# Altium schematic sheet 010_SoC RGMII & GBE PHY.SchDoc
size 420 x 297 mm; Page Create Date: May 29, 2006; WebSite: https://www.seeedstudio.com; Page Number: 10; Drawing: qxn; Schematic Name: BeaglePlay; Page Size: A3; Page Count: 22; Page Name: 010_SoC RGMII & GBE PHY; Company: Seeed Studio; RevCode: v0.2; DsnPath: C:\Users\a0488739\Documents\GitHub\beagleplay\allegro\DVT\BEAGLEPLAYV020_220915.DSN; SchematicName: BeaglePlay; PageName: 010_SoC RGMII & GBE PHY; PageSize: A3; TopSchematic: True
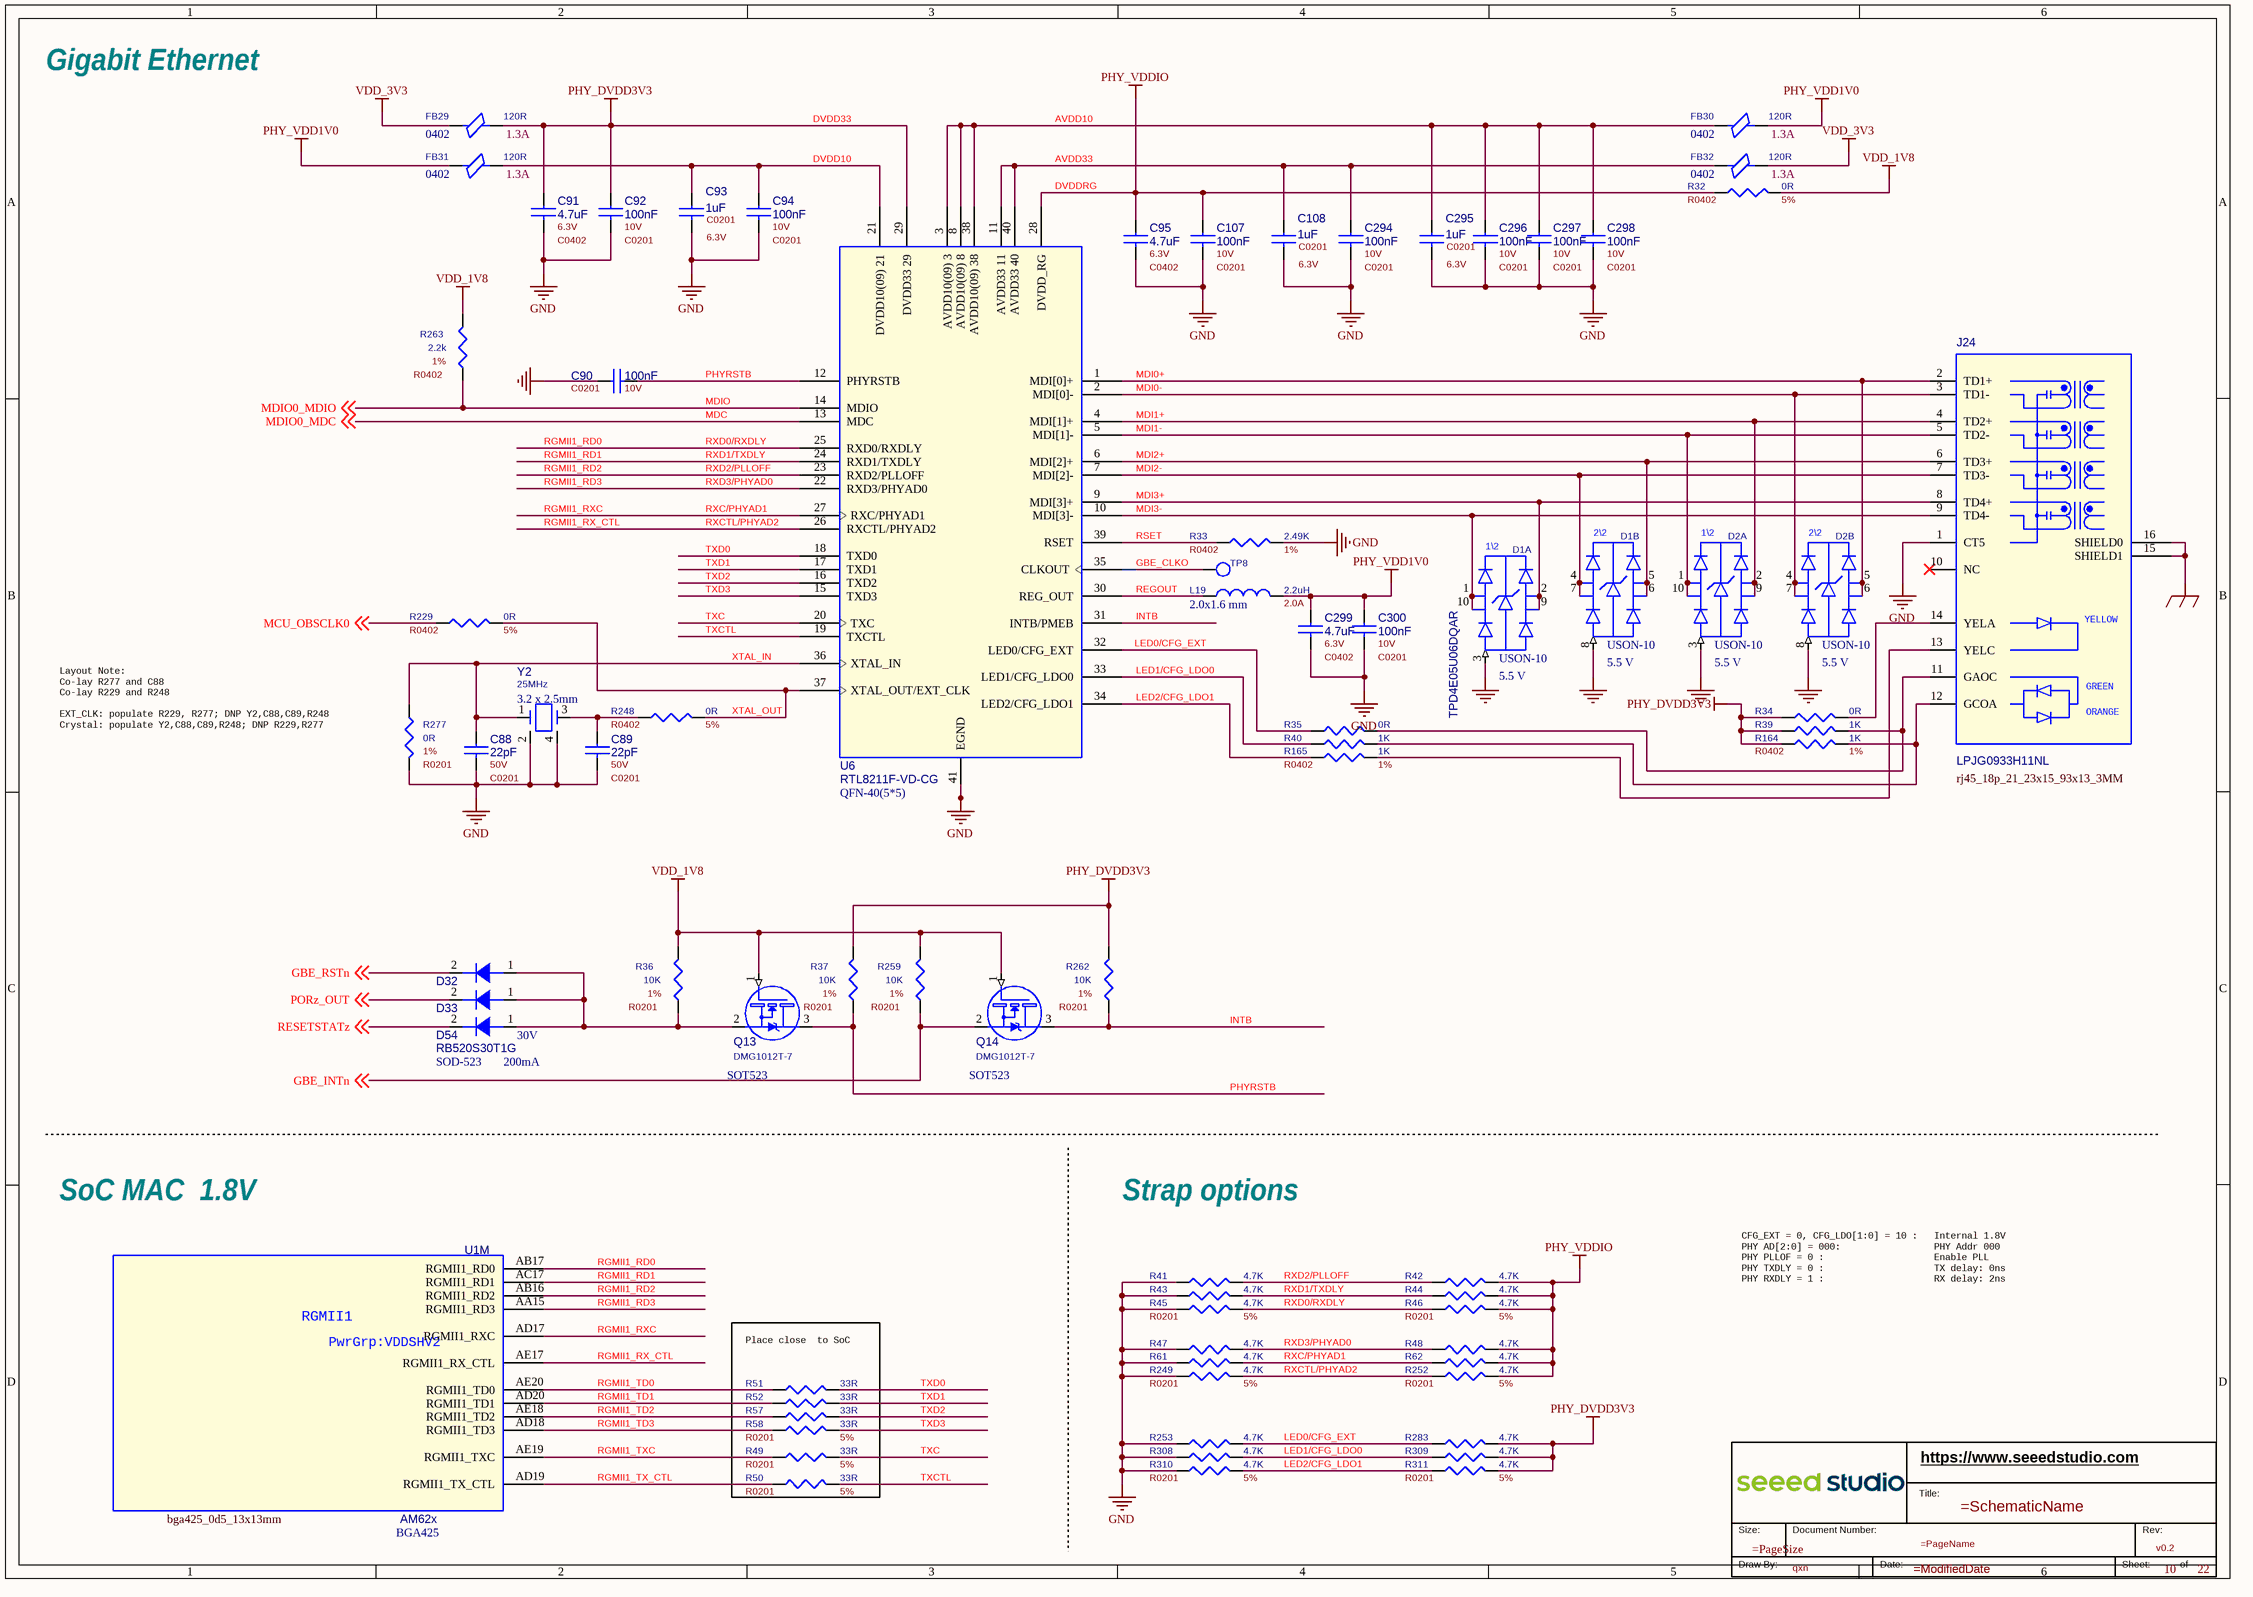
[diagram p0: 010_SoC RGMII & GBE PHY.SchDoc]

## Parts
*  RevCode: v0.2  Page Number: 10  Page Count: 22  Drawing: qxn  (graphical)
C88  value 22pF  Rating: 50V  [C0201]  (hidden comment: CC)
C89  value 22pF  Rating: 50V  [C0201]  (hidden comment: CC)
C90  value 100nF  Rating: 10V  [C0201]  (hidden comment: CC)
C91  value 4.7uF  Rating: 6.3V  [C0402]  (hidden comment: CC)
C92  value 100nF  Rating: 10V  [C0201]  (hidden comment: CC)
C93  value 1uF  Rating: 6.3V  [C0201]  (hidden comment: CC)
C94  value 100nF  Rating: 10V  [C0201]  (hidden comment: CC)
C95  value 4.7uF  Rating: 6.3V  [C0402]  (hidden comment: CC)
C107  value 100nF  Rating: 10V  [C0201]  (hidden comment: CC)
C108  value 1uF  Rating: 6.3V  [C0201]  (hidden comment: CC)
C294  value 100nF  Rating: 10V  [C0201]  (hidden comment: CC)
C295  value 1uF  Rating: 6.3V  [C0201]  (hidden comment: CC)
C296  value 100nF  Rating: 10V  [C0201]  (hidden comment: CC)
C297  value 100nF  Rating: 10V  [C0201]  (hidden comment: CC)
C298  value 100nF  Rating: 10V  [C0201]  (hidden comment: CC)
C299  value 4.7uF  Rating: 6.3V  [C0402]  (hidden comment: CC)
C300  value 100nF  Rating: 10V  [C0201]  (hidden comment: CC)
D1  value TPD4E05U06DQAR  Package Size: USON-10  Rated Voltage: 5.5 V  [uson10_0d5_2d5x1x0d5mm]  (hidden comment: D_ESD_DIFFPAIR)  (parts A,B of 2)
D2  Rated Voltage: 5.5 V  Package Size: USON-10  [uson10_0d5_2d5x1x0d5mm]  (hidden comment: D_ESD_DIFFPAIR)  (parts A,B of 2)
D32  D  [sod_523]  (value not drawn)
D33  D  [sod_523]  (value not drawn)
D54  value RB520S30T1G  Repetitive Reverse Voltage Maximum: 30V  Peak Forward Current: 200mA  Package Size: SOD-523  [sod_523]  (hidden comment: D)
FB29  value 120R  Rating: 1.3A  Package Size: 0402  [L0402]  (hidden comment: FB)
FB30  value 120R  Rating: 1.3A  Package Size: 0402  [L0402]  (hidden comment: FB)
FB31  value 120R  Rating: 1.3A  Package Size: 0402  [L0402]  (hidden comment: FB)
FB32  value 120R  Rating: 1.3A  Package Size: 0402  [L0402]  (hidden comment: FB)
J24  value LPJG0933H11NL  [rj45_18p_21_23x15_93x13_3MM]  (hidden comment: RJ45_LPJG0933H11NL)
L19  value 2.2uH  Rating: 2.0A  Package Size: 2.0x1.6 mm  [L2016]  (hidden comment: L)
Q13  value DMG1012T-7  Package Size: SOT523  [SOT_523]  (hidden comment: NMOS_123)
Q14  value DMG1012T-7  Package Size: SOT523  [SOT_523]  (hidden comment: NMOS_123)
R32  value 0R  Rating: 5%  [R0402]  (hidden comment: R)
R33  value 2.49K  Rating: 1%  [R0402]  (hidden comment: R)
R34  value 0R  [R0402]  (hidden comment: R)
R35  value 0R  [R0402]  (hidden comment: R)
R36  value 10K  Rating: 1%  [R0201]  (hidden comment: R)
R37  value 10K  Rating: 1%  [R0201]  (hidden comment: R)
R39  value 1K  [R0402]  (hidden comment: R)
R40  value 1K  [R0402]  (hidden comment: R)
R41  value 4.7K  [R0201]  (hidden comment: R)
R42  value 4.7K  [R0201]  (hidden comment: R)
R43  value 4.7K  [R0201]  (hidden comment: R)
R44  value 4.7K  [R0201]  (hidden comment: R)
R45  value 4.7K  Rating: 5%  [R0201]  (hidden comment: R)
R46  value 4.7K  Rating: 5%  [R0201]  (hidden comment: R)
R47  value 4.7K  [R0201]  (hidden comment: R)
R48  value 4.7K  [R0201]  (hidden comment: R)
R49  value 33R  Rating: 5%  [R0201]  (hidden comment: R)
R50  value 33R  Rating: 5%  [R0201]  (hidden comment: R)
R51  value 33R  [R0201]  (hidden comment: R)
R52  value 33R  [R0201]  (hidden comment: R)
R57  value 33R  [R0201]  (hidden comment: R)
R58  value 33R  Rating: 5%  [R0201]  (hidden comment: R)
R61  value 4.7K  [R0201]  (hidden comment: R)
R62  value 4.7K  [R0201]  (hidden comment: R)
R164  value 1K  Rating: 1%  [R0402]  (hidden comment: R)
R165  value 1K  Rating: 1%  [R0402]  (hidden comment: R)
R229  value 0R  Rating: 5%  [R0402]  (hidden comment: R)
R248  value 0R  Rating: 5%  [R0402]  (hidden comment: R)
R249  value 4.7K  Rating: 5%  [R0201]  (hidden comment: R)
R252  value 4.7K  Rating: 5%  [R0201]  (hidden comment: R)
R253  value 4.7K  [R0201]  (hidden comment: R)
R259  value 10K  Rating: 1%  [R0201]  (hidden comment: R)
R262  value 10K  Rating: 1%  [R0201]  (hidden comment: R)
R263  value 2.2k  Rating: 1%  [R0402]  (hidden comment: R)
R277  value 0R  Rating: 1%  [R0201]  (hidden comment: R)
R283  value 4.7K  [R0201]  (hidden comment: R)
R308  value 4.7K  [R0201]  (hidden comment: R)
R309  value 4.7K  [R0201]  (hidden comment: R)
R310  value 4.7K  Rating: 5%  [R0201]  (hidden comment: R)
R311  value 4.7K  Rating: 5%  [R0201]  (hidden comment: R)
TP8  Test Point  [tp1-8040]  (value not drawn)
U1  value AM62x  Package Size: BGA425  [bga425_0d5_13x13mm]  (hidden comment: AM62x_BGA425)  (part M of 19)
U6  value RTL8211F-VD-CG  Package Size: QFN-40(5*5)  [qfn40_0D4_5x5mm]  (hidden comment: RTL8211)
Y2  value 25MHz  Package Size: 3.2 x 2.5mm  [CRY-SMD4-CX101F]  (hidden comment: XTAL_4P_2)

## Blocks framed on the sheet
Place close  to SoC: R49-R52 R57 R58

## Nets
DVDD33: C91.1 C92.1 FB29.2 R34.1 R37.1 R39.1 R164.1 R262.1 R283.2 R309.2 R311.2 U6.29(DVDD33_29)  [also labelled PHY_DVDD3V3]
DVDDRG: C95.1 C107.1 R32.1 R42.2 R44.2 R46.2 R48.2 R62.2 R252.2 U6.28(DVDD_RG)  [also labelled PHY_VDDIO]
GND: C88.2 C89.2 C90.1 C91.2 C92.2 C93.2 C94.2 C95.2 C107.2 C108.2 C294.2 C295.2 C296.2 C297.2 C298.2 C299.2 C300.2 D1.3(GND1) D1.8(GND1) D2.3(GND1) D2.8(GND1) J24.1(CT5) R33.2 R41.1 R43.1 R45.1 R47.1 R61.1 R249.1 R253.1 R277.2 R308.1 R310.1 U6.41(EGND) Y2.2(GND) Y2.4(GND)
GND_EARTH: J24.15(SHIELD1) J24.16(SHIELD0)
PHY_VDD1V0: C299.1 C300.1 FB30.2 FB31.1 L19.2
VDD_1V8: Q13.1(G) Q14.1(G) R32.2 R36.1 R259.1 R263.1
VDD_3V3: FB29.1 FB32.2
AVDD10: C295.1 C296.1 C297.1 C298.1 FB30.1 U6.3(AVDD10(09)_3) U6.8(AVDD10(09)_8) U6.38(AVDD10(09)_38)
AVDD33: C108.1 C294.1 FB32.1 U6.11(AVDD33_11) U6.40(AVDD33_40)
DVDD10: C93.1 C94.1 FB31.2 U6.21(DVDD10(09)_21)
GBE_CLKO: TP8.1(TP) U6.35(CLKOUT)
GBE_INTn: Q14.2(S) R259.2 ; off-sheet GBE_INTn
GBE_RSTn: D32.2(C) ; off-sheet GBE_RSTn
INTB: Q14.3(D) R262.2 U6.31(INTB/PMEB)
LED0/CFG_EXT: R35.1 R253.2 R283.1 U6.32(LED0/CFG_EXT)
LED1/CFG_LDO0: R40.1 R308.2 R309.1 U6.33(LED1/CFG_LDO0)
LED2/CFG_LDO1: R165.1 R310.2 R311.1 U6.34(LED2/CFG_LDO1)
MCU_OBSCLK0: R229.1 ; off-sheet MCU_OBSCLK0
MDC: U6.13(MDC) ; off-sheet MDIO0_MDC  [also labelled MDIO0_MDC]
MDI0+: D2.5(4A) D2.6(4B) J24.2(TD1+) U6.1(MDI[0]+)
MDI0-: D2.4(3A) D2.7(3B) J24.3(TD1-) U6.2(MDI[0]-)
MDI1+: D2.2(2A) D2.9(2B) J24.4(TD2+) U6.4(MDI[1]+)
MDI1-: D2.1(1A) D2.10(1B) J24.5(TD2-) U6.5(MDI[1]-)
MDI2+: D1.5(4A) D1.6(4B) J24.6(TD3+) U6.6(MDI[2]+)
MDI2-: D1.4(3A) D1.7(3B) J24.7(TD3-) U6.7(MDI[2]-)
MDI3+: D1.2(2A) D1.9(2B) J24.8(TD4+) U6.9(MDI[3]+)
MDI3-: D1.1(1A) D1.10(1B) J24.9(TD4-) U6.10(MDI[3]-)
MDIO: R263.2 U6.14(MDIO) ; off-sheet MDIO0_MDIO  [also labelled MDIO0_MDIO]
PHYRSTB: C90.2 Q13.3(D) R37.2 U6.12(PHYRSTB)
PORz_OUT: D33.2(C) ; off-sheet PORz_OUT
REGOUT: L19.1 U6.30(REG_OUT)
RESETSTATz: D54.2(C) ; off-sheet RESETSTATz
RGMII1_RD0: R45.2 R46.1 U1.AB17(RGMII1_RD0) U6.25(RXD0/RXDLY)  [also labelled RXD0/RXDLY]
RGMII1_RD1: R43.2 R44.1 U1.AC17(RGMII1_RD1) U6.24(RXD1/TXDLY)  [also labelled RXD1/TXDLY]
RGMII1_RD2: R41.2 R42.1 U1.AB16(RGMII1_RD2) U6.23(RXD2/PLLOFF)  [also labelled RXD2/PLLOFF]
RGMII1_RD3: R47.2 R48.1 U1.AA15(RGMII1_RD3) U6.22(RXD3/PHYAD0)  [also labelled RXD3/PHYAD0]
RGMII1_RX_CTL: R249.2 R252.1 U1.AE17(RGMII1_RX_CTL) U6.26(RXCTL/PHYAD2)  [also labelled RXCTL/PHYAD2]
RGMII1_RXC: R61.2 R62.1 U1.AD17(RGMII1_RXC) U6.27(RXC/PHYAD1)  [also labelled RXC/PHYAD1]
RGMII1_TD0: R51.1 U1.AE20(RGMII1_TD0)
RGMII1_TD1: R52.1 U1.AD20(RGMII1_TD1)
RGMII1_TD2: R57.1 U1.AE18(RGMII1_TD2)
RGMII1_TD3: R58.1 U1.AD18(RGMII1_TD3)
RGMII1_TX_CTL: R50.1 U1.AD19(RGMII1_TX_CTL)
RGMII1_TXC: R49.1 U1.AE19(RGMII1_TXC)
RSET: R33.1 U6.39(RSET)
TXC: R49.2 U6.20(TXC)
TXCTL: R50.2 U6.19(TXCTL)
TXD0: R51.2 U6.18(TXD0)
TXD1: R52.2 U6.17(TXD1)
TXD2: R57.2 U6.16(TXD2)
TXD3: R58.2 U6.15(TXD3)
XTAL_IN: C88.1 R277.1 U6.36(XTAL_IN) Y2.1
XTAL_OUT: R229.2 R248.2 U6.37(XTAL_OUT/EXT_CLK)
NetC89_1: C89.1 R248.1 Y2.3
NetD32_1: D32.1(A) D33.1(A) D54.1(A) Q13.2(S) R36.2
NetJ24_11: J24.11(GAOC) R35.2 R39.2
NetJ24_12: J24.12(GCOA) R40.2 R164.2
NetJ24_13: J24.13(YELC) R165.2
NetJ24_14: J24.14(YELA) R34.2

Not connected (* = marked no-connect by the designer): J24 10(NC)*

## Notes on the sheet
- Gigabit Ethernet
- (near R277) Layout Note:
  Co-lay R277 and C88
  Co-lay R229 and R248
  EXT_CLK: populate R229, R277; DNP Y2,C88,C89,R248
  Crystal: populate Y2,C88,C89,R248; DNP R229,R277
- SoC MAC  1.8V
- Strap options
- CFG_EXT = 0, CFG_LDO[1:0] = 10 :   Internal 1.8V
  PHY AD[2:0] = 000:                 PHY Addr 000
  PHY PLLOF = 0 :                    Enable PLL
  PHY TXDLY = 0 :                    TX delay: 0ns
  PHY RXDLY = 1 :                    RX delay: 2ns
- (in symbol AM62x_BGA425, part M) RGMII1; PwrGrp:VDDSHV2
- (in symbol D_ESD_DIFFPAIR, part A) 1\2
- (in symbol D_ESD_DIFFPAIR, part B) 2\2
- (in symbol RJ45_LPJG0933H11NL) YELLOW; GREEN; ORANGE
- (in symbol Seeed Title) https://www.seeedstudio.com; Title:; Size:; Document Number:; Rev:; Draw By:; Date:; Sheet:; of

## Library data of the parts
* = Seeed Title: Company: Seeed Studio; WebSite: https://www.seeedstudio.com; Schematic Name: =SchematicName; Page Size: =PageSize; Page Name: =PageName; Page Create Date: May 29, 2006; Page Modify Date: =ModifiedDate
C88 = CC: CAP, Ceramic, SMD, 22pF, 5%, 50V, 0201; Part Reference: C88; Company Part Status: BeagleV-Ahead; Manufacturer: YAGEO; Manufacturer PN: CC0201JRNPO9BN220; PN: 302010273; Temperature Coefficient: NPO; CLASS: DISCRETE; PCB Footprint: C0201; Package Size: 0201; Dielectric Type: Ceramic; Tolerance: 5%
C89 = CC: CAP, Ceramic, SMD, 22pF, 5%, 50V, 0201; Part Reference: C89; Manufacturer PN: CC0201JRNPO9BN220; Manufacturer: YAGEO; Company Part Status: BeagleV-Ahead; CLASS: DISCRETE; Temperature Coefficient: NPO; PN: 302010273; PCB Footprint: C0201; Tolerance: 5%; Dielectric Type: Ceramic; Package Size: 0201
C90 = CC: CAP, Ceramic, SMD, 100nF, 10%, 10V, 0201; Part Reference: C90; Manufacturer PN: CC0201KRX5R6BB104; Manufacturer: YAGEO; Company Part Status: ODYSSEY-i.MX8M; CLASS: DISCRETE; Temperature Coefficient: X5R; PN: 302010271; PCB Footprint: C0201; Tolerance: 10%; Dielectric Type: Ceramic; Package Size: 0201
C91 = CC: CAP, Ceramic, SMD, 4.7uF, 20%, 6.3V, 0402; Part Reference: C91; Company Part Status: BeagleBone Carrier Board; Manufacturer: YAGEO; Manufacturer PN: CC0402MRX5R5BB475; PN: 302010019; Temperature Coefficient: X5R; CLASS: DISCRETE; SIGNAL_MODEL: DEFAULT_CAPACITOR_4.7e+06pF_1_2; PCB Footprint: C0402; Package Size: 0402; Dielectric Type: Ceramic; Tolerance: 20%
C92 = CC: CAP, Ceramic, SMD, 100nF, 10%, 10V, 0201; Part Reference: C92; Manufacturer PN: CC0201KRX5R6BB104; Manufacturer: YAGEO; Company Part Status: ODYSSEY-i.MX8M; CLASS: DISCRETE; Temperature Coefficient: X5R; PN: 302010271; SIGNAL_MODEL: DEFAULT_CAPACITOR_100000pF_1_2; PCB Footprint: C0201; Tolerance: 10%; Dielectric Type: Ceramic; Package Size: 0201
C93 = CC: CAP, Ceramic, SMD, 1uF, 20%, 6.3V, 0201; Part Reference: C93; Company Part Status: ODYSSEY-i.MX8M; Manufacturer: YAGEO; Manufacturer PN: CC0201MRX5R5BB105; PN: 302010270; Temperature Coefficient: X5R; CLASS: DISCRETE; PCB Footprint: C0201; Package Size: 0201; Dielectric Type: Ceramic; Tolerance: 20%
C94 = CC: CAP, Ceramic, SMD, 100nF, 10%, 10V, 0201; Part Reference: C94; Company Part Status: ODYSSEY-i.MX8M; Manufacturer: YAGEO; Manufacturer PN: CC0201KRX5R6BB104; SIGNAL_MODEL: DEFAULT_CAPACITOR_100000pF_1_2; PN: 302010271; Temperature Coefficient: X5R; CLASS: DISCRETE; PCB Footprint: C0201; Package Size: 0201; Dielectric Type: Ceramic; Tolerance: 10%
C95 = CC: CAP, Ceramic, SMD, 4.7uF, 20%, 6.3V, 0402; Part Reference: C95; Company Part Status: BeagleBone Carrier Board; Manufacturer: YAGEO; Manufacturer PN: CC0402MRX5R5BB475; PN: 302010019; Temperature Coefficient: X5R; CLASS: DISCRETE; SIGNAL_MODEL: DEFAULT_CAPACITOR_4.7e+06pF_1_2; PCB Footprint: C0402; Package Size: 0402; Dielectric Type: Ceramic; Tolerance: 20%
C107 = CC: CAP, Ceramic, SMD, 100nF, 10%, 10V, 0201; Part Reference: C107; Manufacturer PN: CC0201KRX5R6BB104; Manufacturer: YAGEO; Company Part Status: ODYSSEY-i.MX8M; CLASS: DISCRETE; Temperature Coefficient: X5R; PN: 302010271; SIGNAL_MODEL: DEFAULT_CAPACITOR_100000pF_1_2; PCB Footprint: C0201; Tolerance: 10%; Dielectric Type: Ceramic; Package Size: 0201
C108 = CC: CAP, Ceramic, SMD, 1uF, 20%, 6.3V, 0201; Part Reference: C108; Manufacturer PN: CC0201MRX5R5BB105; Manufacturer: YAGEO; Company Part Status: ODYSSEY-i.MX8M; CLASS: DISCRETE; Temperature Coefficient: X5R; PN: 302010270; PCB Footprint: C0201; Tolerance: 20%; Dielectric Type: Ceramic; Package Size: 0201
C294 = CC: CAP, Ceramic, SMD, 100nF, 10%, 10V, 0201; Part Reference: C294; Manufacturer PN: CC0201KRX5R6BB104; Manufacturer: YAGEO; Company Part Status: ODYSSEY-i.MX8M; CLASS: DISCRETE; Temperature Coefficient: X5R; PN: 302010271; SIGNAL_MODEL: DEFAULT_CAPACITOR_100000pF_1_2; PCB Footprint: C0201; Tolerance: 10%; Dielectric Type: Ceramic; Package Size: 0201
C295 = CC: CAP, Ceramic, SMD, 1uF, 20%, 6.3V, 0201; Part Reference: C295; Manufacturer PN: CC0201MRX5R5BB105; Manufacturer: YAGEO; Company Part Status: ODYSSEY-i.MX8M; CLASS: DISCRETE; Temperature Coefficient: X5R; PN: 302010270; PCB Footprint: C0201; Tolerance: 20%; Dielectric Type: Ceramic; Package Size: 0201
C296 = CC: CAP, Ceramic, SMD, 100nF, 10%, 10V, 0201; Part Reference: C296; Company Part Status: ODYSSEY-i.MX8M; Manufacturer: YAGEO; Manufacturer PN: CC0201KRX5R6BB104; SIGNAL_MODEL: DEFAULT_CAPACITOR_100000pF_1_2; PN: 302010271; Temperature Coefficient: X5R; CLASS: DISCRETE; PCB Footprint: C0201; Package Size: 0201; Dielectric Type: Ceramic; Tolerance: 10%
C297 = CC: CAP, Ceramic, SMD, 100nF, 10%, 10V, 0201; Part Reference: C297; Company Part Status: ODYSSEY-i.MX8M; Manufacturer: YAGEO; Manufacturer PN: CC0201KRX5R6BB104; SIGNAL_MODEL: DEFAULT_CAPACITOR_100000pF_1_2; PN: 302010271; Temperature Coefficient: X5R; CLASS: DISCRETE; PCB Footprint: C0201; Package Size: 0201; Dielectric Type: Ceramic; Tolerance: 10%
C298 = CC: CAP, Ceramic, SMD, 100nF, 10%, 10V, 0201; Part Reference: C298; Company Part Status: ODYSSEY-i.MX8M; Manufacturer: YAGEO; Manufacturer PN: CC0201KRX5R6BB104; SIGNAL_MODEL: DEFAULT_CAPACITOR_100000pF_1_2; PN: 302010271; Temperature Coefficient: X5R; CLASS: DISCRETE; PCB Footprint: C0201; Package Size: 0201; Dielectric Type: Ceramic; Tolerance: 10%
C299 = CC: CAP, Ceramic, SMD, 4.7uF, 20%, 6.3V, 0402; Part Reference: C299; Manufacturer PN: CC0402MRX5R5BB475; Manufacturer: YAGEO; Company Part Status: BeagleBone Carrier Board; SIGNAL_MODEL: DEFAULT_CAPACITOR_4.7e+06pF_1_2; CLASS: DISCRETE; Temperature Coefficient: X5R; PN: 302010019; PCB Footprint: C0402; Tolerance: 20%; Dielectric Type: Ceramic; Package Size: 0402
C300 = CC: CAP, Ceramic, SMD, 100nF, 10%, 10V, 0201; Part Reference: C300; Manufacturer PN: CC0201KRX5R6BB104; Manufacturer: YAGEO; Company Part Status: ODYSSEY-i.MX8M; CLASS: DISCRETE; Temperature Coefficient: X5R; PN: 302010271; SIGNAL_MODEL: DEFAULT_CAPACITOR_100000pF_1_2; PCB Footprint: C0201; Tolerance: 10%; Dielectric Type: Ceramic; Package Size: 0201
D1 = D_ESD_DIFFPAIR: DIO, ESD, TPD4E05U06DQAR, --, 5.5 V, --, USON-10; Part Reference: D1; Company Part Status: JetsonMate; Manufacturer: TI; PN: 304060294; Repetitive Reverse Voltage Maximum: 6.5 V; CLASS: DISCRETE; PCB Footprint: uson10_0d5_2d5x1x0d5mm; Manufacturer PN: TPD4E05U06DQAR
D2 = D_ESD_DIFFPAIR: DIO, ESD, TPD4E05U06DQAR, --, 5.5 V, --, USON-10; Part Reference: D2; Manufacturer: TI; Company Part Status: JetsonMate; CLASS: DISCRETE; Repetitive Reverse Voltage Maximum: 6.5 V; PN: 304060294; Value: TPD4E05U06DQAR; PCB Footprint: uson10_0d5_2d5x1x0d5mm; Manufacturer PN: TPD4E05U06DQAR
D32 = D: DIO, Schottky, RB520S30T1G, , , , SOD-523; Part Reference: D32; Manufacturer: ON; Company Part Status: SCG Vehicle Device; CLASS: DISCRETE; Repetitive Reverse Voltage Maximum: 30V; Peak Forward Current: 200mA; PN: 304020782; PCB Footprint: sod_523; Value: RB520S30T1G; Manufacturer PN: RB520S30T1G; Package Size: SOD-523
D33 = D: DIO, Schottky, RB520S30T1G, , , , SOD-523; Part Reference: D33; Company Part Status: SCG Vehicle Device; Manufacturer: ON; PN: 304020782; Peak Forward Current: 200mA; Repetitive Reverse Voltage Maximum: 30V; CLASS: DISCRETE; PCB Footprint: sod_523; Value: RB520S30T1G; Package Size: SOD-523; Manufacturer PN: RB520S30T1G
D54 = D: DIO, Schottky, RB520S30T1G, , , , SOD-523; Part Reference: D54; Manufacturer: ON; Company Part Status: SCG Vehicle Device; CLASS: DISCRETE; PN: 304020782; PCB Footprint: sod_523; Manufacturer PN: RB520S30T1G
FB29 = FB: Ferrite Bead, 120R, , 1.3A, 0402; Part Reference: FB29; Company Part Status: BeagleBone Carrier Board; Manufacturer: Murata; Manufacturer PN: BLM15PD121SN1D; PN: 303030040; CLASS: DISCRETE; PCB Footprint: L0402
FB30 = FB: Ferrite Bead, 120R, , 1.3A, 0402; Part Reference: FB30; Manufacturer PN: BLM15PD121SN1D; Manufacturer: Murata; Company Part Status: BeagleBone Carrier Board; CLASS: DISCRETE; PN: 303030040; PCB Footprint: L0402
FB31 = FB: Ferrite Bead, 120R, , 1.3A, 0402; Part Reference: FB31; Manufacturer PN: BLM15PD121SN1D; Manufacturer: Murata; Company Part Status: BeagleBone Carrier Board; CLASS: DISCRETE; PN: 303030040; PCB Footprint: L0402
FB32 = FB: Ferrite Bead, 120R, , 1.3A, 0402; Part Reference: FB32; Company Part Status: BeagleBone Carrier Board; Manufacturer: Murata; Manufacturer PN: BLM15PD121SN1D; PN: 303030040; CLASS: DISCRETE; PCB Footprint: L0402
J24 = RJ45_LPJG0933H11NL: CONN, RJ45, LPJG0933H11NL, 16P, DIP; Part Reference: J24; Manufacturer: LINK-PP; Company Part Status: BeaglePlay; FPLIST: rj45_18p_LPJG0801HBNL,rj45_18p_21_23x15_93x13_3MM; CLASS: IO; PN: 320140517; PCB Footprint: rj45_18p_21_23x15_93x13_3MM; Manufacturer PN: LPJG0933H11NL; Package Size: 16P-21.25*15.93*13.3mm
L19 = L: Power Inductor, 2.2uH, 20%, 2.0A, 2.0x1.6 mm; Part Reference: L19; Manufacturer PN: CSTB201610H-2R2M; Manufacturer: CODACA; Company Part Status: BeagleV-Ahead; CLASS: DISCRETE; PN: 303011791; PCB Footprint: L2016
Q13 = NMOS_123: XSTR, MOSFET, N-Channel, DMG1012T-7, 20V, 630mA, SOT523, SMD; Part Reference: Q13; Company Part Status: BeagleX; Manufacturer: Diodes; PN: 305030659; CLASS: DISCRETE; PCB Footprint: SOT_523; Polarity: N-Channel; Manufacturer PN: DMG1012T-7
Q14 = NMOS_123: XSTR, MOSFET, N-Channel, DMG1012T-7, 20V, 630mA, SOT523, SMD; Part Reference: Q14; Company Part Status: BeagleX; Manufacturer: Diodes; PN: 305030659; CLASS: DISCRETE; PCB Footprint: SOT_523; Polarity: N-Channel; Manufacturer PN: DMG1012T-7
R32 = R: RES, Thick Film, 0R, 5%, 1/16W, SMD, 0402; Part Reference: R32; Company Part Status: BeagleBone Carrier Board; Manufacturer: YAGEO; Manufacturer PN: RC0402JR-070RL; PN: 301010000; CLASS: DISCRETE; PCB Footprint: R0402; Package Size: 0402; Rated Power: 1/16W
R33 = R: RES, Thick Film, 2.49K, 1%, 1/16W, SMD, 0402; Part Reference: R33; Company Part Status: ODYSSEY-i.MX8M; Manufacturer: YAGEO; Manufacturer PN: RC0402FR-072K49L; PN: 301010856; CLASS: DISCRETE; PCB Footprint: R0402; Package Size: 0402; Rated Power: 1/16W
R34 = R: RES, Thick Film, 0R, 5%, 1/16W, SMD, 0402; Part Reference: R34; Manufacturer PN: RC0402JR-070RL; Manufacturer: YAGEO; Company Part Status: BeagleBone Carrier Board; CLASS: DISCRETE; PN: 301010000; Rating: 5%; PCB Footprint: R0402; Rated Power: 1/16W; Package Size: 0402
R35 = R: RES, Thick Film, 0R, 5%, 1/16W, SMD, 0402; Part Reference: R35; Manufacturer PN: RC0402JR-070RL; Manufacturer: YAGEO; Company Part Status: BeagleBone Carrier Board; CLASS: DISCRETE; PN: 301010000; Rating: 5%; PCB Footprint: R0402; Rated Power: 1/16W; Package Size: 0402
R36 = R: RES, Thick Film, 10K, 1%, 1/20W, SMD, 0201; Part Reference: R36; Manufacturer PN: RC0201FR-0710KL; Manufacturer: YAGEO; Company Part Status: RV PI; CLASS: DISCRETE; PN: 301010526; PCB Footprint: R0201; Package Size: 0201; Rated Power: 1/20W
R37 = R: RES, Thick Film, 10K, 1%, 1/20W, SMD, 0201; Part Reference: R37; Company Part Status: RV PI; Manufacturer: YAGEO; Manufacturer PN: RC0201FR-0710KL; PN: 301010526; CLASS: DISCRETE; PCB Footprint: R0201; Package Size: 0201; Rated Power: 1/20W
R39 = R: RES, Thick Film, 1K, 1%, 1/16W, SMD, 0402; Part Reference: R39; Company Part Status: Combox Pro; Manufacturer: YAGEO; Manufacturer PN: RC0402FR-071KL; PN: 301010044; CLASS: DISCRETE; Rating: 1%; PCB Footprint: R0402; Package Size: 0402; Rated Power: 1/16W
R40 = R: RES, Thick Film, 1K, 1%, 1/16W, SMD, 0402; Part Reference: R40; Company Part Status: Combox Pro; Manufacturer: YAGEO; Manufacturer PN: RC0402FR-071KL; PN: 301010044; CLASS: DISCRETE; Rating: 1%; PCB Footprint: R0402; Package Size: 0402; Rated Power: 1/16W
R41 = R: RES, Thick Film, 4.7K, 5%, 1/20W, SMD, 0201; Part Reference: R41; Manufacturer PN: RC0201JR-074K7L; Manufacturer: YAGEO; Company Part Status: BeagleV-Ahead; CLASS: DISCRETE; PN: 301010677; Rating: 5%; PCB Footprint: R0201; Rated Power: 1/20W; Package Size: 0201
R42 = R: RES, Thick Film, 4.7K, 5%, 1/20W, SMD, 0201; Part Reference: R42; Company Part Status: BeagleV-Ahead; Manufacturer: YAGEO; Manufacturer PN: RC0201JR-074K7L; PN: 301010677; CLASS: DISCRETE; Rating: 5%; PCB Footprint: R0201; Package Size: 0201; Rated Power: 1/20W
R43 = R: RES, Thick Film, 4.7K, 5%, 1/20W, SMD, 0201; Part Reference: R43; Manufacturer PN: RC0201JR-074K7L; Manufacturer: YAGEO; Company Part Status: BeagleV-Ahead; CLASS: DISCRETE; PN: 301010677; Rating: 5%; PCB Footprint: R0201; Rated Power: 1/20W; Package Size: 0201
R44 = R: RES, Thick Film, 4.7K, 5%, 1/20W, SMD, 0201; Part Reference: R44; Company Part Status: BeagleV-Ahead; Manufacturer: YAGEO; Manufacturer PN: RC0201JR-074K7L; PN: 301010677; CLASS: DISCRETE; Rating: 5%; PCB Footprint: R0201; Package Size: 0201; Rated Power: 1/20W
R45 = R: RES, Thick Film, 4.7K, 5%, 1/20W, SMD, 0201; Part Reference: R45; Manufacturer PN: RC0201JR-074K7L; Manufacturer: YAGEO; Company Part Status: BeagleV-Ahead; CLASS: DISCRETE; PN: 301010677; PCB Footprint: R0201; Rated Power: 1/20W; Package Size: 0201
R46 = R: RES, Thick Film, 4.7K, 5%, 1/20W, SMD, 0201; Part Reference: R46; Company Part Status: BeagleV-Ahead; Manufacturer: YAGEO; Manufacturer PN: RC0201JR-074K7L; PN: 301010677; CLASS: DISCRETE; PCB Footprint: R0201; Package Size: 0201; Rated Power: 1/20W
R47 = R: RES, Thick Film, 4.7K, 5%, 1/20W, SMD, 0201; Part Reference: R47; Manufacturer PN: RC0201JR-074K7L; Manufacturer: YAGEO; Company Part Status: BeagleV-Ahead; CLASS: DISCRETE; PN: 301010677; Rating: 5%; PCB Footprint: R0201; Rated Power: 1/20W; Package Size: 0201
R48 = R: RES, Thick Film, 4.7K, 5%, 1/20W, SMD, 0201; Part Reference: R48; Manufacturer PN: RC0201JR-074K7L; Manufacturer: YAGEO; Company Part Status: BeagleV-Ahead; CLASS: DISCRETE; PN: 301010677; Rating: 5%; PCB Footprint: R0201; Rated Power: 1/20W; Package Size: 0201
R49 = R: RES, Thick Film, 33R, 5%, 1/20W, SMD, 0201; Part Reference: R49; Manufacturer PN: RC0201JR-0733RL; Manufacturer: YAGEO; Company Part Status: BeagleBone Carrier Board; CLASS: DISCRETE; PN: 301010675; PCB Footprint: R0201; Rated Power: 1/20W; Package Size: 0201
R50 = R: RES, Thick Film, 33R, 5%, 1/20W, SMD, 0201; Part Reference: R50; Manufacturer PN: RC0201JR-0733RL; Manufacturer: YAGEO; Company Part Status: BeagleBone Carrier Board; CLASS: DISCRETE; PN: 301010675; PCB Footprint: R0201; Rated Power: 1/20W; Package Size: 0201
R51 = R: RES, Thick Film, 33R, 5%, 1/20W, SMD, 0201; Part Reference: R51; Manufacturer PN: RC0201JR-0733RL; Manufacturer: YAGEO; Company Part Status: BeagleBone Carrier Board; CLASS: DISCRETE; PN: 301010675; Rating: 5%; PCB Footprint: R0201; Rated Power: 1/20W; Package Size: 0201
R52 = R: RES, Thick Film, 33R, 5%, 1/20W, SMD, 0201; Part Reference: R52; Manufacturer PN: RC0201JR-0733RL; Manufacturer: YAGEO; Company Part Status: BeagleBone Carrier Board; CLASS: DISCRETE; PN: 301010675; Rating: 5%; PCB Footprint: R0201; Rated Power: 1/20W; Package Size: 0201
R57 = R: RES, Thick Film, 33R, 5%, 1/20W, SMD, 0201; Part Reference: R57; Manufacturer PN: RC0201JR-0733RL; Manufacturer: YAGEO; Company Part Status: BeagleBone Carrier Board; CLASS: DISCRETE; PN: 301010675; Rating: 5%; PCB Footprint: R0201; Rated Power: 1/20W; Package Size: 0201
R58 = R: RES, Thick Film, 33R, 5%, 1/20W, SMD, 0201; Part Reference: R58; Manufacturer PN: RC0201JR-0733RL; Manufacturer: YAGEO; Company Part Status: BeagleBone Carrier Board; CLASS: DISCRETE; PN: 301010675; PCB Footprint: R0201; Rated Power: 1/20W; Package Size: 0201
R61 = R: RES, Thick Film, 4.7K, 5%, 1/20W, SMD, 0201; Part Reference: R61; Manufacturer PN: RC0201JR-074K7L; Manufacturer: YAGEO; Company Part Status: BeagleV-Ahead; CLASS: DISCRETE; PN: 301010677; Rating: 5%; PCB Footprint: R0201; Rated Power: 1/20W; Package Size: 0201
R62 = R: RES, Thick Film, 4.7K, 5%, 1/20W, SMD, 0201; Part Reference: R62; Manufacturer PN: RC0201JR-074K7L; Manufacturer: YAGEO; Company Part Status: BeagleV-Ahead; CLASS: DISCRETE; PN: 301010677; Rating: 5%; PCB Footprint: R0201; Rated Power: 1/20W; Package Size: 0201
R164 = R: RES, Thick Film, 1K, 1%, 1/16W, SMD, 0402; Part Reference: R164; Company Part Status: Combox Pro; Manufacturer: YAGEO; Manufacturer PN: RC0402FR-071KL; PN: 301010044; CLASS: DISCRETE; PCB Footprint: R0402; Package Size: 0402; Rated Power: 1/16W
R165 = R: RES, Thick Film, 1K, 1%, 1/16W, SMD, 0402; Part Reference: R165; Company Part Status: Combox Pro; Manufacturer: YAGEO; Manufacturer PN: RC0402FR-071KL; PN: 301010044; CLASS: DISCRETE; PCB Footprint: R0402; Package Size: 0402; Rated Power: 1/16W
R229 = R: RES, Thick Film, 0R, 5%, 1/16W, SMD, 0402; Part Reference: R229; Manufacturer PN: RC0402JR-070RL; Manufacturer: YAGEO; Company Part Status: BeagleBone Carrier Board; CLASS: DISCRETE; PN: 301010000; PCB Footprint: R0402; Rated Power: 1/16W; Package Size: 0402
R248 = R: RES, Thick Film, 0R, 5%, 1/16W, SMD, 0402; Part Reference: R248; Manufacturer PN: RC0402JR-070RL; Manufacturer: YAGEO; Company Part Status: BeagleBone Carrier Board; CLASS: DISCRETE; PN: 301010000; PCB Footprint: R0402; Rated Power: 1/16W; Package Size: 0402
R249 = R: RES, Thick Film, 4.7K, 5%, 1/20W, SMD, 0201; Part Reference: R249; Manufacturer PN: RC0201JR-074K7L; Manufacturer: YAGEO; Company Part Status: BeagleV-Ahead; CLASS: DISCRETE; PN: 301010677; PCB Footprint: R0201; Rated Power: 1/20W; Package Size: 0201
R252 = R: RES, Thick Film, 4.7K, 5%, 1/20W, SMD, 0201; Part Reference: R252; Manufacturer PN: RC0201JR-074K7L; Manufacturer: YAGEO; Company Part Status: BeagleV-Ahead; CLASS: DISCRETE; PN: 301010677; PCB Footprint: R0201; Rated Power: 1/20W; Package Size: 0201
R253 = R: RES, Thick Film, 4.7K, 5%, 1/20W, SMD, 0201; Part Reference: R253; Manufacturer PN: RC0201JR-074K7L; Manufacturer: YAGEO; Company Part Status: BeagleV-Ahead; CLASS: DISCRETE; PN: 301010677; Rating: 5%; PCB Footprint: R0201; Rated Power: 1/20W; Package Size: 0201
R259 = R: RES, Thick Film, 10K, 1%, 1/20W, SMD, 0201; Part Reference: R259; Manufacturer PN: RC0201FR-0710KL; Manufacturer: YAGEO; Company Part Status: RV PI; CLASS: DISCRETE; PN: 301010526; PCB Footprint: R0201; Package Size: 0201; Rated Power: 1/20W
R262 = R: RES, Thick Film, 10K, 1%, 1/20W, SMD, 0201; Part Reference: R262; Company Part Status: RV PI; Manufacturer: YAGEO; Manufacturer PN: RC0201FR-0710KL; PN: 301010526; CLASS: DISCRETE; PCB Footprint: R0201; Package Size: 0201; Rated Power: 1/20W
R263 = R: RES, Thick Film, 2.2k, 1%, 1/16W, SMD, 0402; Part Reference: R263; Company Part Status: ST; Manufacturer: YAGEO; Manufacturer PN: RC0402FR-072K2L; PN: 301010746; CLASS: DISCRETE; PCB Footprint: R0402; Rated Power: 1/16W; Package Size: 0402
R277 = R: RES, Thick Film, 0R, 5%, 1/20W, SMD, 0201; Part Reference: R277; Company Part Status: BeagleBone Carrier Board; Manufacturer: YAGEO; Manufacturer PN: RC0201FR-070RL; PN: 301010525; CLASS: DISCRETE; PCB Footprint: R0201; Package Size: 0201; Rated Power: 1/20W
R283 = R: RES, Thick Film, 4.7K, 5%, 1/20W, SMD, 0201; Part Reference: R283; Company Part Status: BeagleV-Ahead; Manufacturer: YAGEO; Manufacturer PN: RC0201JR-074K7L; PN: 301010677; CLASS: DISCRETE; Rating: 5%; PCB Footprint: R0201; Package Size: 0201; Rated Power: 1/20W
R308 = R: RES, Thick Film, 4.7K, 5%, 1/20W, SMD, 0201; Part Reference: R308; Manufacturer PN: RC0201JR-074K7L; Manufacturer: YAGEO; Company Part Status: BeagleV-Ahead; CLASS: DISCRETE; PN: 301010677; Rating: 5%; PCB Footprint: R0201; Rated Power: 1/20W; Package Size: 0201
R309 = R: RES, Thick Film, 4.7K, 5%, 1/20W, SMD, 0201; Part Reference: R309; Company Part Status: BeagleV-Ahead; Manufacturer: YAGEO; Manufacturer PN: RC0201JR-074K7L; PN: 301010677; CLASS: DISCRETE; Rating: 5%; PCB Footprint: R0201; Package Size: 0201; Rated Power: 1/20W
R310 = R: RES, Thick Film, 4.7K, 5%, 1/20W, SMD, 0201; Part Reference: R310; Manufacturer PN: RC0201JR-074K7L; Manufacturer: YAGEO; Company Part Status: BeagleV-Ahead; CLASS: DISCRETE; PN: 301010677; PCB Footprint: R0201; Rated Power: 1/20W; Package Size: 0201
R311 = R: RES, Thick Film, 4.7K, 5%, 1/20W, SMD, 0201; Part Reference: R311; Company Part Status: BeagleV-Ahead; Manufacturer: YAGEO; Manufacturer PN: RC0201JR-074K7L; PN: 301010677; CLASS: DISCRETE; PCB Footprint: R0201; Package Size: 0201; Rated Power: 1/20W
TP8 = Test Point: MISC, Test Point, Test Point, SMD, TP30C_SMD; Part Reference: TP8; Company Part Status: Grove Base Cape for PocketBeagle; ASSY: DNP; CLASS: DISCRETE; PCB Footprint: TP30C_SMD; Value: Test Point; PN: TP30C_SMD; Package Size: TP30C_SMD
U1 = AM62x_BGA425: IC, Controller, MPU, AM62x, BGA425; Part Reference: U1; Company Part Status: BeaglePlay; Manufacturer: TI; Manufacturer PN: AM6254ATCGGHALWR; PN: 310011537; PCB Footprint: bga425_0d5_13x13mm; CLASS: IC
U6 = RTL8211: IC, Interface, Ethernet, RTL8211F-VD-CG, QFN-40(5*5); Part Reference: U6; Manufacturer: Realtek; Company Part Status: BeagleV-Ahead; PN: 310991199; PCB Footprint: qfn40_0D4_5x5mm; Manufacturer PN: RTL8211F-VD-CG; CLASS: IC
Y2 = XTAL_4P_2: Crystal, SMD, 25MHz, 20 ppm, 18pF; Part Reference: Y2; Manufacturer PN: 5YAA25000182TF40Q3; Manufacturer: Interquip; Company Part Status: Jetson Edge AI; ATHEROS KEY: 122-00011-000; PCB Footprint: X4-SMD-3_2X2_5X1_0MM; CLASS: DISCRETE; Frequency Tolerance: 20 ppm; PN: 306011192